# Altium schematic sheet User IO Buffers.SchDoc
size A1; SheetNumber: 13; SheetTotal: 13
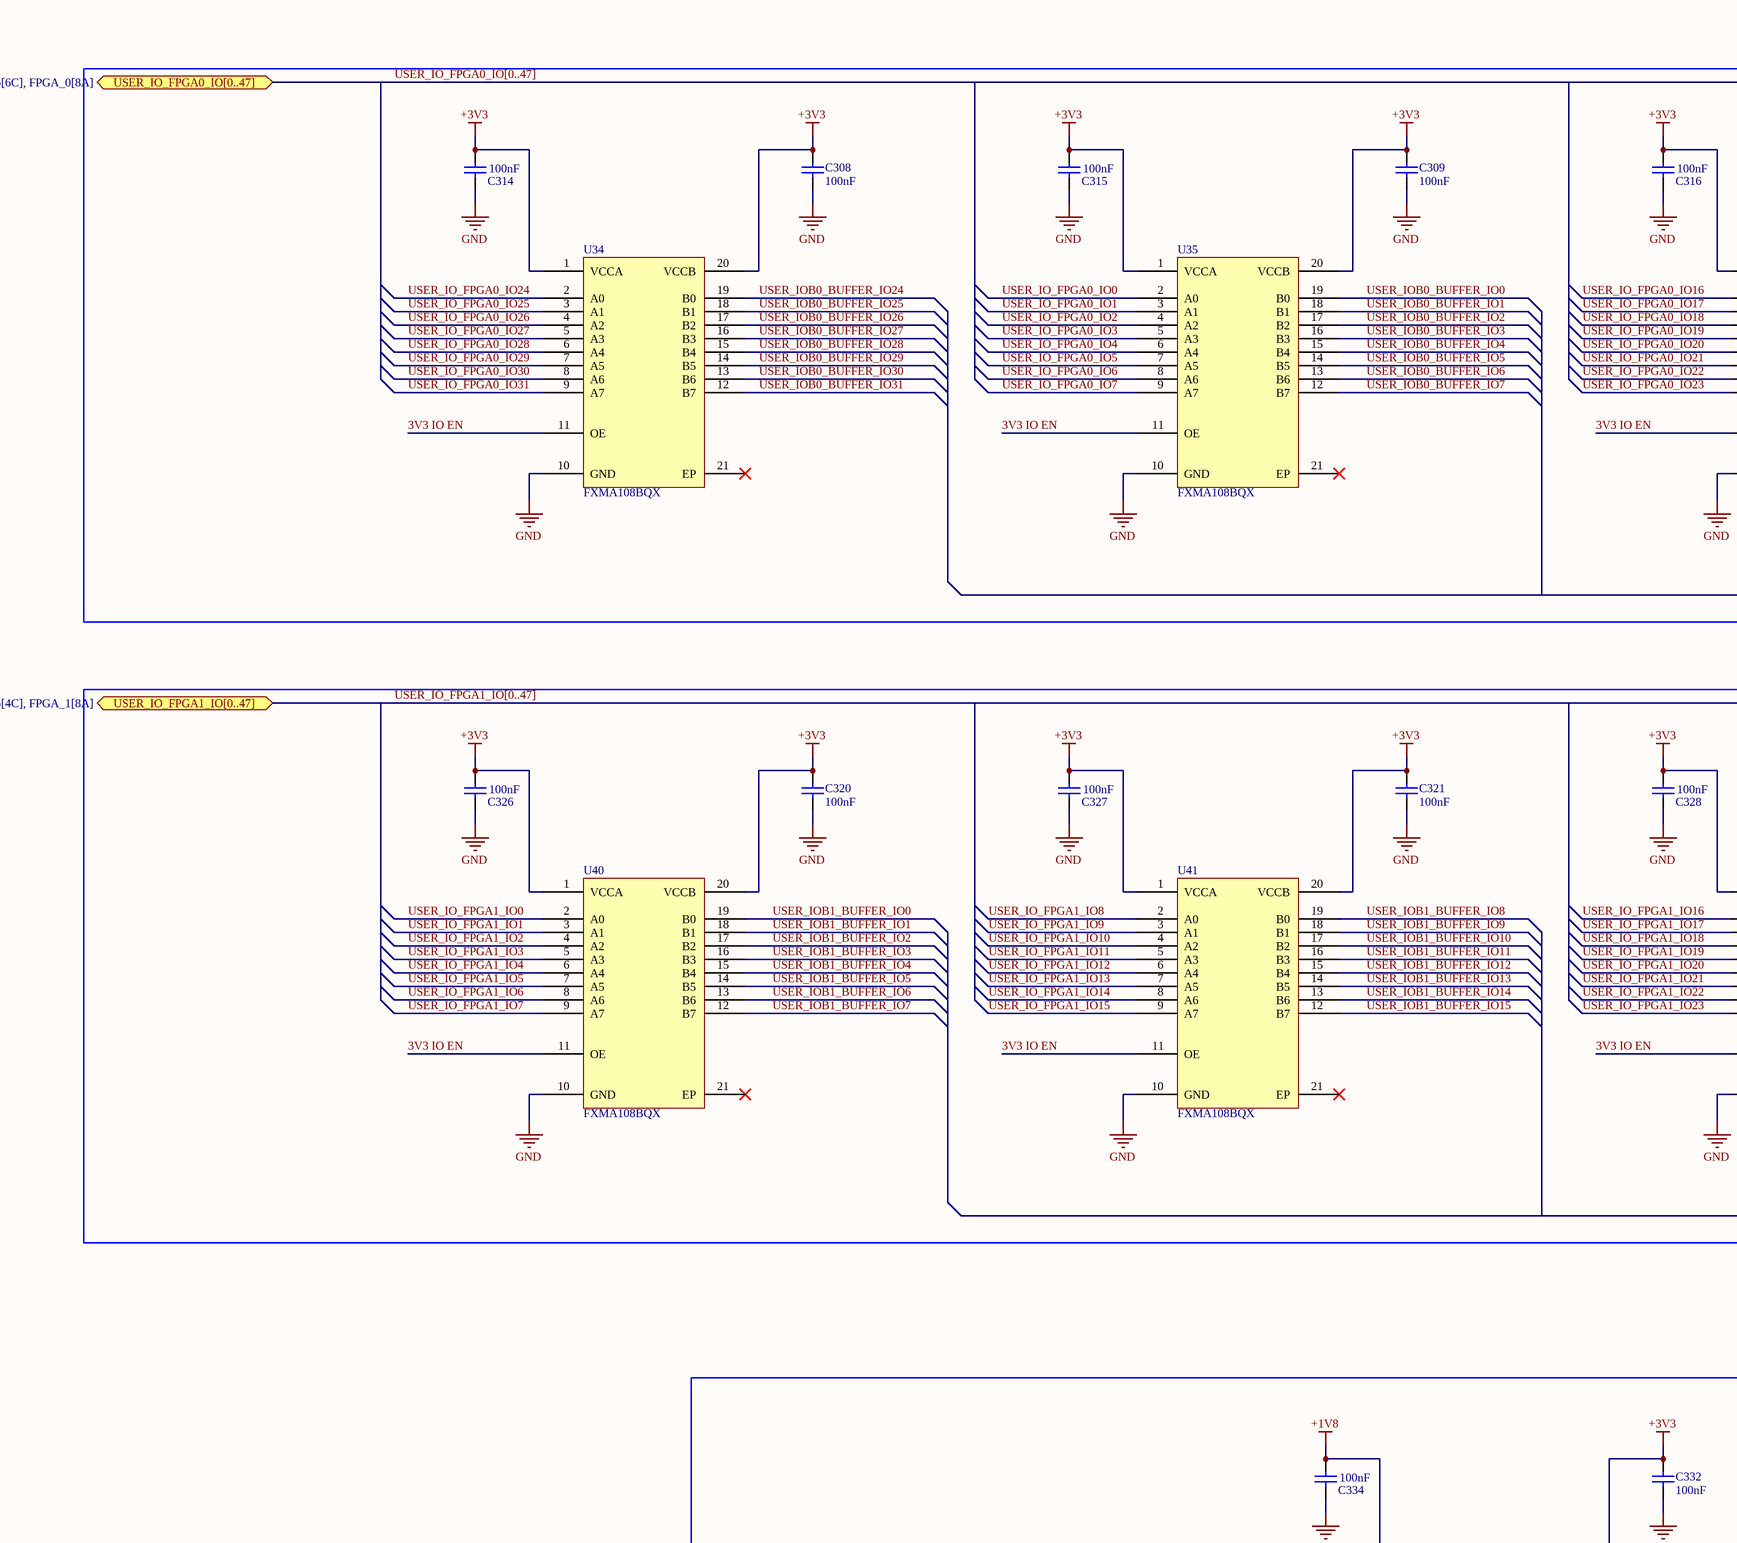
[diagram p0: User IO Buffers.SchDoc, top left]
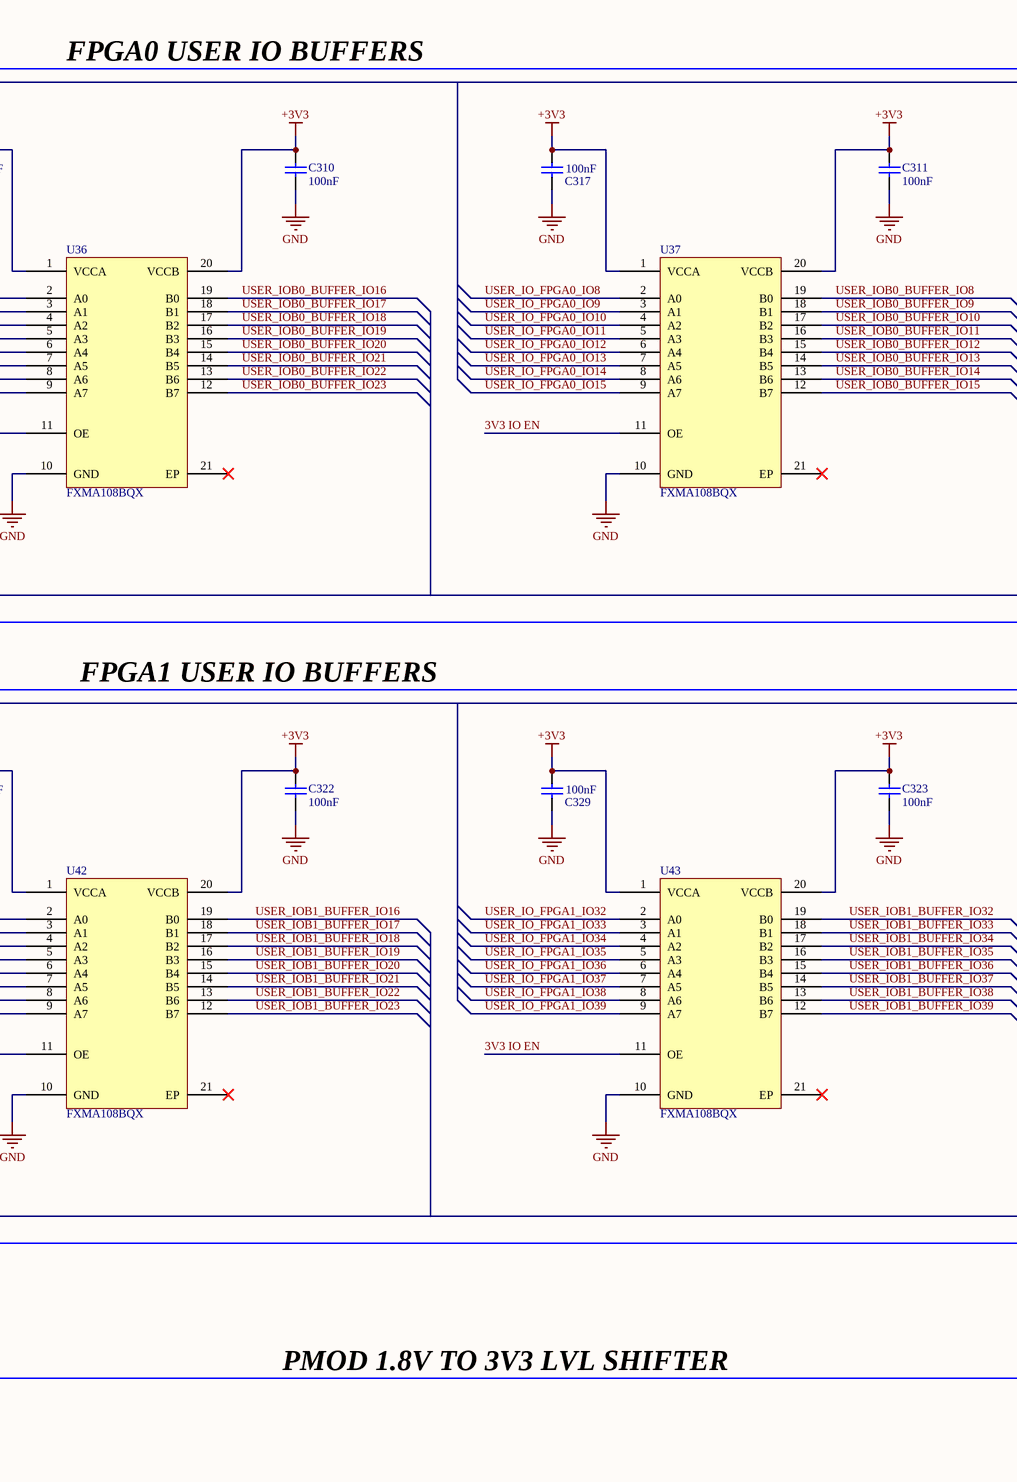
[diagram p1: User IO Buffers.SchDoc, top middle]
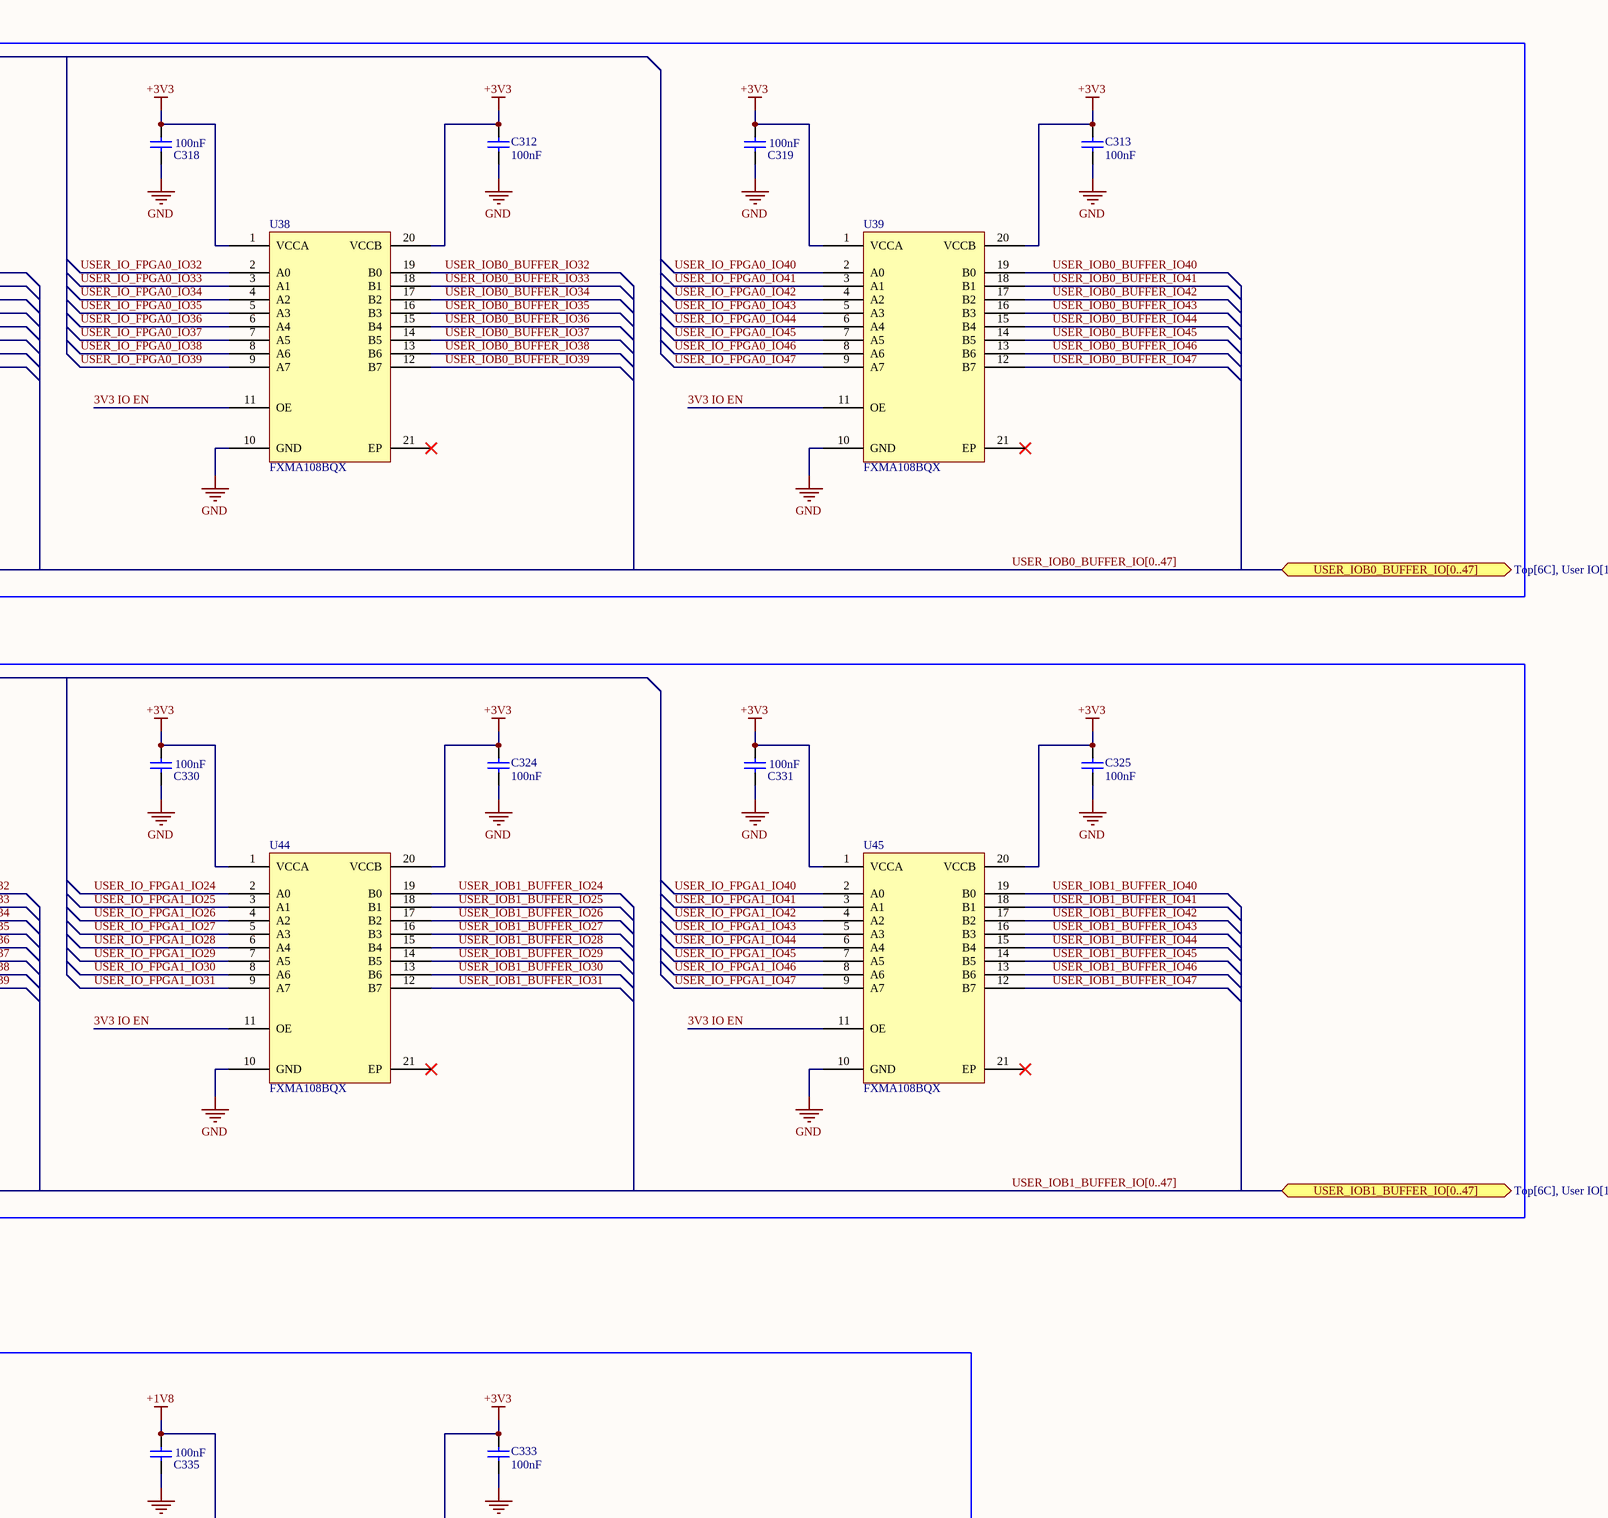
[diagram p2: User IO Buffers.SchDoc, top right]
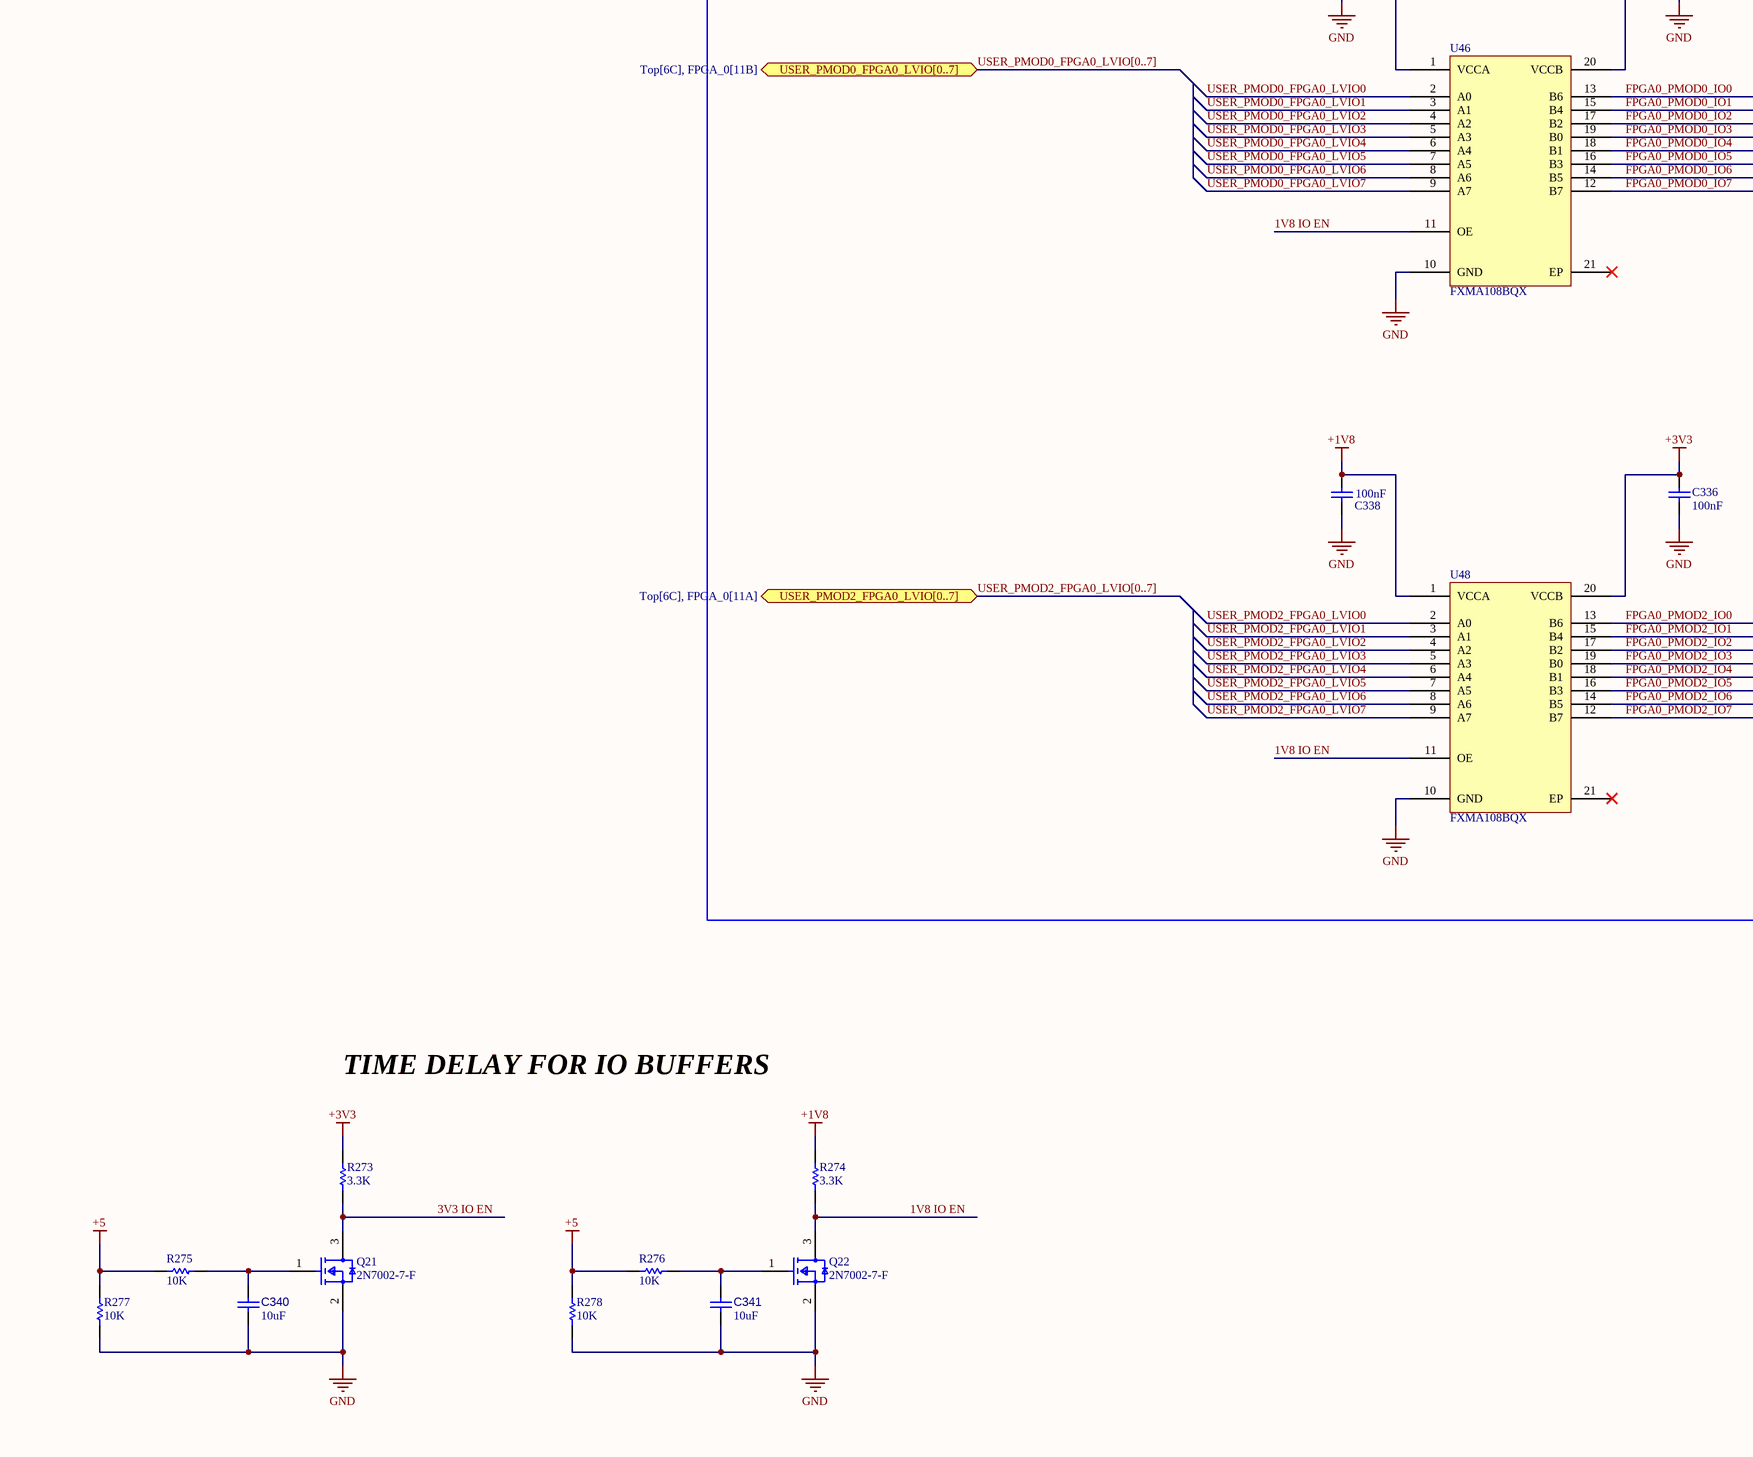
[diagram p3: User IO Buffers.SchDoc, bottom left]
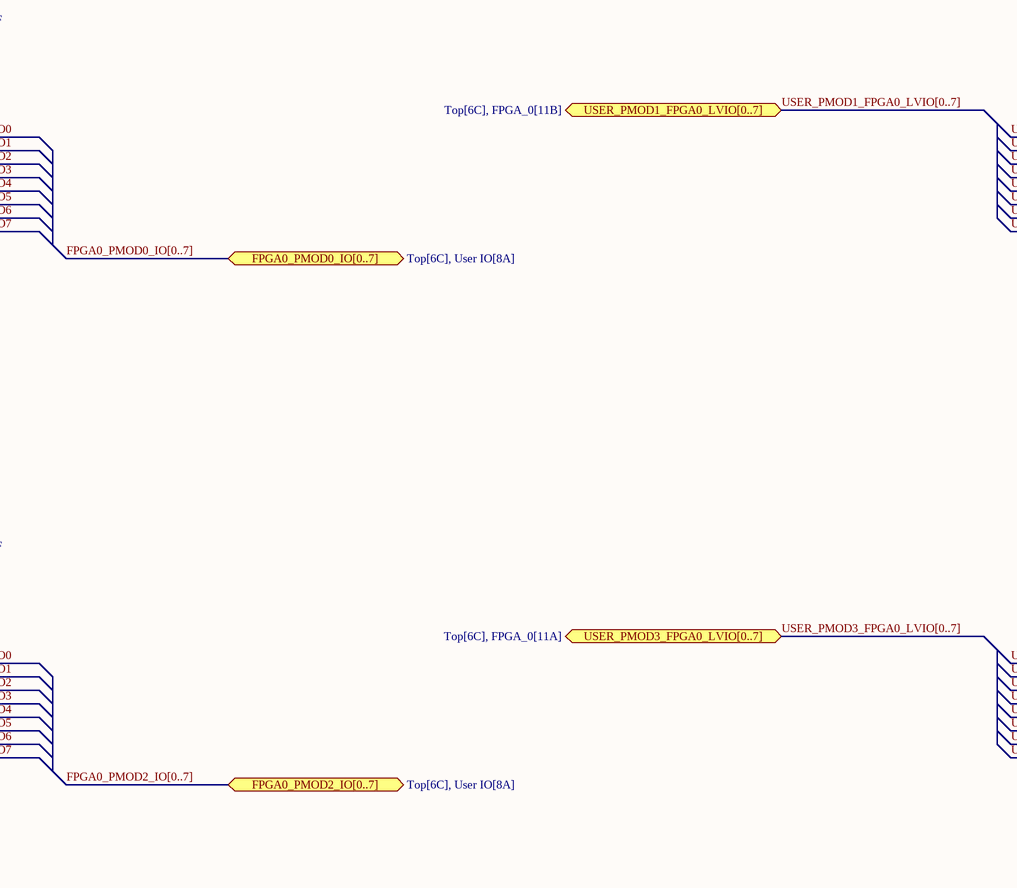
[diagram p4: User IO Buffers.SchDoc, bottom middle]
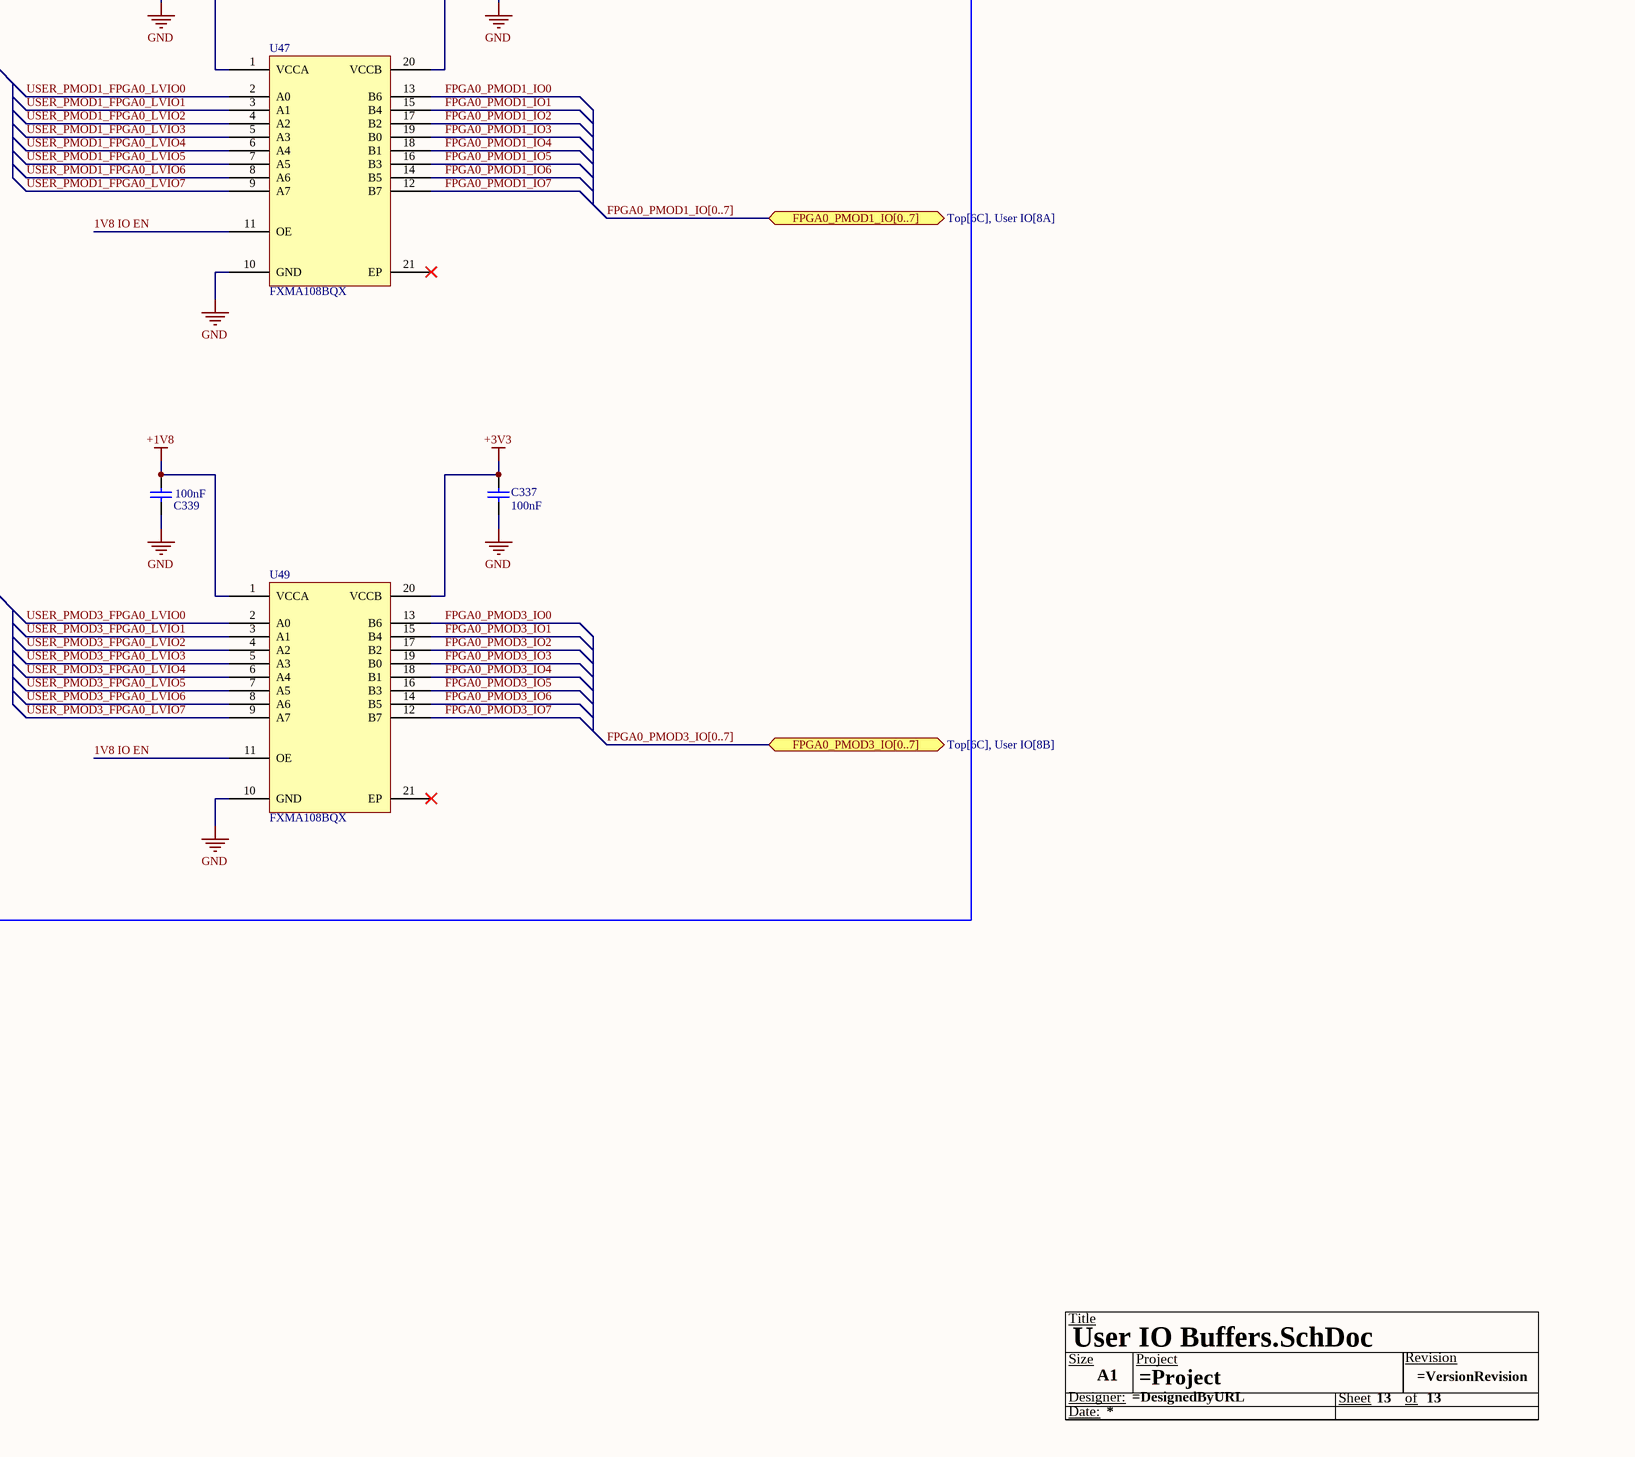
[diagram p5: User IO Buffers.SchDoc, bottom right]

## Parts
*  Size: A1  (hidden comment: Title Block)  (graphical)
C308  100nF  [CAPC1005X05N]
C309  100nF  [CAPC1005X05N]
C310  100nF  [CAPC1005X05N]
C311  100nF  [CAPC1005X05N]
C312  100nF  [CAPC1005X05N]
C313  100nF  [CAPC1005X05N]
C314  100nF  [CAPC1005X05N]
C315  100nF  [CAPC1005X05N]
C316  100nF  [CAPC1005X05N]
C317  100nF  [CAPC1005X05N]
C318  100nF  [CAPC1005X05N]
C319  100nF  [CAPC1005X05N]
C320  100nF  [CAPC1005X05N]
C321  100nF  [CAPC1005X05N]
C322  100nF  [CAPC1005X05N]
C323  100nF  [CAPC1005X05N]
C324  100nF  [CAPC1005X05N]
C325  100nF  [CAPC1005X05N]
C326  100nF  [CAPC1005X05N]
C327  100nF  [CAPC1005X05N]
C328  100nF  [CAPC1005X05N]
C329  100nF  [CAPC1005X05N]
C330  100nF  [CAPC1005X05N]
C331  100nF  [CAPC1005X05N]
C332  100nF  [CAPC1005X05N]
C333  100nF  [CAPC1005X05N]
C334  100nF  [CAPC1005X05N]
C335  100nF  [CAPC1005X05N]
C336  100nF  [CAPC1005X05N]
C337  100nF  [CAPC1005X05N]
C338  100nF  [CAPC1005X05N]
C339  100nF  [CAPC1005X05N]
C340  value 10uF  [CAPC1608X04N]  (hidden comment: GRM188R61E106MA73D)
C341  value 10uF  [CAPC1608X04N]  (hidden comment: GRM188R61E106MA73D)
Q21  2N7002-7-F  [FP-SOT23-MFG]
Q22  2N7002-7-F  [FP-SOT23-MFG]
R273  3.3K  [RESC1005X40X25NL05T10]
R274  3.3K  [RESC1005X40X25NL05T10]
R275  10K  [RESC1005X40X25NL05T10]
R276  10K  [RESC1005X40X25NL05T10]
R277  10K  [RESC1005X40X25NL05T10]
R278  10K  [RESC1005X40X25NL05T10]
U34  FXMA108BQX  [QFN50P450X250X80_HS-21N]
U35  FXMA108BQX  [QFN50P450X250X80_HS-21N]
U36  FXMA108BQX  [QFN50P450X250X80_HS-21N]
U37  FXMA108BQX  [QFN50P450X250X80_HS-21N]
U38  FXMA108BQX  [QFN50P450X250X80_HS-21N]
U39  FXMA108BQX  [QFN50P450X250X80_HS-21N]
U40  FXMA108BQX  [QFN50P450X250X80_HS-21N]
U41  FXMA108BQX  [QFN50P450X250X80_HS-21N]
U42  FXMA108BQX  [QFN50P450X250X80_HS-21N]
U43  FXMA108BQX  [QFN50P450X250X80_HS-21N]
U44  FXMA108BQX  [QFN50P450X250X80_HS-21N]
U45  FXMA108BQX  [QFN50P450X250X80_HS-21N]
U46  FXMA108BQX  [QFN50P450X250X80_HS-21N]
U47  FXMA108BQX  [QFN50P450X250X80_HS-21N]
U48  FXMA108BQX  [QFN50P450X250X80_HS-21N]
U49  FXMA108BQX  [QFN50P450X250X80_HS-21N]

## Blocks framed on the sheet
FPGA0 USER IO BUFFERS: C308-C319 U34-U39
FPGA1 USER IO BUFFERS: C320-C331 U40-U45
PMOD 1.8V TO 3V3 LVL SHIFTER: C332-C339 U46-U49

## Ports
FPGA0_PMOD0_IO[0..7] (bidir, see Top[6C], User IO[8A]), FPGA0_PMOD1_IO[0..7] (bidir, see Top[6C], User IO[8A]), FPGA0_PMOD2_IO[0..7] (bidir, see Top[6C], User IO[8A]), FPGA0_PMOD3_IO[0..7] (bidir, see Top[6C], User IO[8B]), USER_IO_FPGA0_IO[0..47] (bidir, see Top[6C], FPGA_0[8A]), USER_IO_FPGA1_IO[0..47] (bidir, see Top[4C], FPGA_1[8A]), USER_IOB0_BUFFER_IO[0..47] (bidir, see Top[6C], User IO[1A]), USER_IOB1_BUFFER_IO[0..47] (bidir, see Top[6C], User IO[1B]), USER_PMOD0_FPGA0_LVIO[0..7] (bidir, see Top[6C], FPGA_0[11B]), USER_PMOD1_FPGA0_LVIO[0..7] (bidir, see Top[6C], FPGA_0[11B]), USER_PMOD2_FPGA0_LVIO[0..7] (bidir, see Top[6C], FPGA_0[11A]), USER_PMOD3_FPGA0_LVIO[0..7] (bidir, see Top[6C], FPGA_0[11A])

## Nets
+1V8: C334.2 C335.2 C338.2 C339.2 R274.2 U46.1(VCCA) U47.1(VCCA) U48.1(VCCA) U49.1(VCCA)
+3V3: C308.2 C309.2 C310.2 C311.2 C312.2 C313.2 C314.2 C315.2 C316.2 C317.2 C318.2 C319.2 C320.2 C321.2 C322.2 C323.2 C324.2 C325.2 C326.2 C327.2 C328.2 C329.2 C330.2 C331.2 C332.2 C333.2 C336.2 C337.2 R273.2 U34.1(VCCA) U34.20(VCCB) U35.1(VCCA) U35.20(VCCB) U36.1(VCCA) U36.20(VCCB) U37.1(VCCA) U37.20(VCCB) U38.1(VCCA) U38.20(VCCB) U39.1(VCCA) U39.20(VCCB) U40.1(VCCA) U40.20(VCCB) U41.1(VCCA) U41.20(VCCB) U42.1(VCCA) U42.20(VCCB) U43.1(VCCA) U43.20(VCCB) U44.1(VCCA) U44.20(VCCB) U45.1(VCCA) U45.20(VCCB) U46.20(VCCB) U47.20(VCCB) U48.20(VCCB) U49.20(VCCB)
+5: R275.2 R276.2 R277.1 R278.1
GND: C308.1 C309.1 C310.1 C311.1 C312.1 C313.1 C314.1 C315.1 C316.1 C317.1 C318.1 C319.1 C320.1 C321.1 C322.1 C323.1 C324.1 C325.1 C326.1 C327.1 C328.1 C329.1 C330.1 C331.1 C332.1 C333.1 C334.1 C335.1 C336.1 C337.1 C338.1 C339.1 C340.1 C341.1 Q21.2(S) Q22.2(S) R277.2 R278.2 U34.10(GND) U35.10(GND) U36.10(GND) U37.10(GND) U38.10(GND) U39.10(GND) U40.10(GND) U41.10(GND) U42.10(GND) U43.10(GND) U44.10(GND) U45.10(GND) U46.10(GND) U47.10(GND) U48.10(GND) U49.10(GND)
1V8 IO EN: Q22.3(D) R274.1 U46.11(OE) U47.11(OE) U48.11(OE) U49.11(OE)
3V3 IO EN: Q21.3(D) R273.1 U34.11(OE) U35.11(OE) U36.11(OE) U37.11(OE) U38.11(OE) U39.11(OE) U40.11(OE) U41.11(OE) U42.11(OE) U43.11(OE) U44.11(OE) U45.11(OE)
FPGA0_PMOD0_IO0: U46.13(B6)
FPGA0_PMOD0_IO1: U46.15(B4)
FPGA0_PMOD0_IO2: U46.17(B2)
FPGA0_PMOD0_IO3: U46.19(B0)
FPGA0_PMOD0_IO4: U46.18(B1)
FPGA0_PMOD0_IO5: U46.16(B3)
FPGA0_PMOD0_IO6: U46.14(B5)
FPGA0_PMOD0_IO7: U46.12(B7)
FPGA0_PMOD1_IO0: U47.13(B6)
FPGA0_PMOD1_IO1: U47.15(B4)
FPGA0_PMOD1_IO2: U47.17(B2)
FPGA0_PMOD1_IO3: U47.19(B0)
FPGA0_PMOD1_IO4: U47.18(B1)
FPGA0_PMOD1_IO5: U47.16(B3)
FPGA0_PMOD1_IO6: U47.14(B5)
FPGA0_PMOD1_IO7: U47.12(B7)
FPGA0_PMOD2_IO0: U48.13(B6)
FPGA0_PMOD2_IO1: U48.15(B4)
FPGA0_PMOD2_IO2: U48.17(B2)
FPGA0_PMOD2_IO3: U48.19(B0)
FPGA0_PMOD2_IO4: U48.18(B1)
FPGA0_PMOD2_IO5: U48.16(B3)
FPGA0_PMOD2_IO6: U48.14(B5)
FPGA0_PMOD2_IO7: U48.12(B7)
FPGA0_PMOD3_IO0: U49.13(B6)
FPGA0_PMOD3_IO1: U49.15(B4)
FPGA0_PMOD3_IO2: U49.17(B2)
FPGA0_PMOD3_IO3: U49.19(B0)
FPGA0_PMOD3_IO4: U49.18(B1)
FPGA0_PMOD3_IO5: U49.16(B3)
FPGA0_PMOD3_IO6: U49.14(B5)
FPGA0_PMOD3_IO7: U49.12(B7)
USER_IO_FPGA0_IO0: U35.2(A0)
USER_IO_FPGA0_IO1: U35.3(A1)
USER_IO_FPGA0_IO2: U35.4(A2)
USER_IO_FPGA0_IO3: U35.5(A3)
USER_IO_FPGA0_IO4: U35.6(A4)
USER_IO_FPGA0_IO5: U35.7(A5)
USER_IO_FPGA0_IO6: U35.8(A6)
USER_IO_FPGA0_IO7: U35.9(A7)
USER_IO_FPGA0_IO8: U37.2(A0)
USER_IO_FPGA0_IO9: U37.3(A1)
USER_IO_FPGA0_IO10: U37.4(A2)
USER_IO_FPGA0_IO11: U37.5(A3)
USER_IO_FPGA0_IO12: U37.6(A4)
USER_IO_FPGA0_IO13: U37.7(A5)
USER_IO_FPGA0_IO14: U37.8(A6)
USER_IO_FPGA0_IO15: U37.9(A7)
USER_IO_FPGA0_IO16: U36.2(A0)
USER_IO_FPGA0_IO17: U36.3(A1)
USER_IO_FPGA0_IO18: U36.4(A2)
USER_IO_FPGA0_IO19: U36.5(A3)
USER_IO_FPGA0_IO20: U36.6(A4)
USER_IO_FPGA0_IO21: U36.7(A5)
USER_IO_FPGA0_IO22: U36.8(A6)
USER_IO_FPGA0_IO23: U36.9(A7)
USER_IO_FPGA0_IO24: U34.2(A0)
USER_IO_FPGA0_IO25: U34.3(A1)
USER_IO_FPGA0_IO26: U34.4(A2)
USER_IO_FPGA0_IO27: U34.5(A3)
USER_IO_FPGA0_IO28: U34.6(A4)
USER_IO_FPGA0_IO29: U34.7(A5)
USER_IO_FPGA0_IO30: U34.8(A6)
USER_IO_FPGA0_IO31: U34.9(A7)
USER_IO_FPGA0_IO32: U38.2(A0)
USER_IO_FPGA0_IO33: U38.3(A1)
USER_IO_FPGA0_IO34: U38.4(A2)
USER_IO_FPGA0_IO35: U38.5(A3)
USER_IO_FPGA0_IO36: U38.6(A4)
USER_IO_FPGA0_IO37: U38.7(A5)
USER_IO_FPGA0_IO38: U38.8(A6)
USER_IO_FPGA0_IO39: U38.9(A7)
USER_IO_FPGA0_IO40: U39.2(A0)
USER_IO_FPGA0_IO41: U39.3(A1)
USER_IO_FPGA0_IO42: U39.4(A2)
USER_IO_FPGA0_IO43: U39.5(A3)
USER_IO_FPGA0_IO44: U39.6(A4)
USER_IO_FPGA0_IO45: U39.7(A5)
USER_IO_FPGA0_IO46: U39.8(A6)
USER_IO_FPGA0_IO47: U39.9(A7)
USER_IO_FPGA1_IO0: U40.2(A0)
USER_IO_FPGA1_IO1: U40.3(A1)
USER_IO_FPGA1_IO2: U40.4(A2)
USER_IO_FPGA1_IO3: U40.5(A3)
USER_IO_FPGA1_IO4: U40.6(A4)
USER_IO_FPGA1_IO5: U40.7(A5)
USER_IO_FPGA1_IO6: U40.8(A6)
USER_IO_FPGA1_IO7: U40.9(A7)
USER_IO_FPGA1_IO8: U41.2(A0)
USER_IO_FPGA1_IO9: U41.3(A1)
USER_IO_FPGA1_IO10: U41.4(A2)
USER_IO_FPGA1_IO11: U41.5(A3)
USER_IO_FPGA1_IO12: U41.6(A4)
USER_IO_FPGA1_IO13: U41.7(A5)
USER_IO_FPGA1_IO14: U41.8(A6)
USER_IO_FPGA1_IO15: U41.9(A7)
USER_IO_FPGA1_IO16: U42.2(A0)
USER_IO_FPGA1_IO17: U42.3(A1)
USER_IO_FPGA1_IO18: U42.4(A2)
USER_IO_FPGA1_IO19: U42.5(A3)
USER_IO_FPGA1_IO20: U42.6(A4)
USER_IO_FPGA1_IO21: U42.7(A5)
USER_IO_FPGA1_IO22: U42.8(A6)
USER_IO_FPGA1_IO23: U42.9(A7)
USER_IO_FPGA1_IO24: U44.2(A0)
USER_IO_FPGA1_IO25: U44.3(A1)
USER_IO_FPGA1_IO26: U44.4(A2)
USER_IO_FPGA1_IO27: U44.5(A3)
USER_IO_FPGA1_IO28: U44.6(A4)
USER_IO_FPGA1_IO29: U44.7(A5)
USER_IO_FPGA1_IO30: U44.8(A6)
USER_IO_FPGA1_IO31: U44.9(A7)
USER_IO_FPGA1_IO32: U43.2(A0)
USER_IO_FPGA1_IO33: U43.3(A1)
USER_IO_FPGA1_IO34: U43.4(A2)
USER_IO_FPGA1_IO35: U43.5(A3)
USER_IO_FPGA1_IO36: U43.6(A4)
USER_IO_FPGA1_IO37: U43.7(A5)
USER_IO_FPGA1_IO38: U43.8(A6)
USER_IO_FPGA1_IO39: U43.9(A7)
USER_IO_FPGA1_IO40: U45.2(A0)
USER_IO_FPGA1_IO41: U45.3(A1)
USER_IO_FPGA1_IO42: U45.4(A2)
USER_IO_FPGA1_IO43: U45.5(A3)
USER_IO_FPGA1_IO44: U45.6(A4)
USER_IO_FPGA1_IO45: U45.7(A5)
USER_IO_FPGA1_IO46: U45.8(A6)
USER_IO_FPGA1_IO47: U45.9(A7)
USER_IOB0_BUFFER_IO0: U35.19(B0)
USER_IOB0_BUFFER_IO1: U35.18(B1)
USER_IOB0_BUFFER_IO2: U35.17(B2)
USER_IOB0_BUFFER_IO3: U35.16(B3)
USER_IOB0_BUFFER_IO4: U35.15(B4)
USER_IOB0_BUFFER_IO5: U35.14(B5)
USER_IOB0_BUFFER_IO6: U35.13(B6)
USER_IOB0_BUFFER_IO7: U35.12(B7)
USER_IOB0_BUFFER_IO8: U37.19(B0)
USER_IOB0_BUFFER_IO9: U37.18(B1)
USER_IOB0_BUFFER_IO10: U37.17(B2)
USER_IOB0_BUFFER_IO11: U37.16(B3)
USER_IOB0_BUFFER_IO12: U37.15(B4)
USER_IOB0_BUFFER_IO13: U37.14(B5)
USER_IOB0_BUFFER_IO14: U37.13(B6)
USER_IOB0_BUFFER_IO15: U37.12(B7)
USER_IOB0_BUFFER_IO16: U36.19(B0)
USER_IOB0_BUFFER_IO17: U36.18(B1)
USER_IOB0_BUFFER_IO18: U36.17(B2)
USER_IOB0_BUFFER_IO19: U36.16(B3)
USER_IOB0_BUFFER_IO20: U36.15(B4)
USER_IOB0_BUFFER_IO21: U36.14(B5)
USER_IOB0_BUFFER_IO22: U36.13(B6)
USER_IOB0_BUFFER_IO23: U36.12(B7)
USER_IOB0_BUFFER_IO24: U34.19(B0)
USER_IOB0_BUFFER_IO25: U34.18(B1)
USER_IOB0_BUFFER_IO26: U34.17(B2)
USER_IOB0_BUFFER_IO27: U34.16(B3)
USER_IOB0_BUFFER_IO28: U34.15(B4)
USER_IOB0_BUFFER_IO29: U34.14(B5)
USER_IOB0_BUFFER_IO30: U34.13(B6)
USER_IOB0_BUFFER_IO31: U34.12(B7)
USER_IOB0_BUFFER_IO32: U38.19(B0)
USER_IOB0_BUFFER_IO33: U38.18(B1)
USER_IOB0_BUFFER_IO34: U38.17(B2)
USER_IOB0_BUFFER_IO35: U38.16(B3)
USER_IOB0_BUFFER_IO36: U38.15(B4)
USER_IOB0_BUFFER_IO37: U38.14(B5)
USER_IOB0_BUFFER_IO38: U38.13(B6)
USER_IOB0_BUFFER_IO39: U38.12(B7)
USER_IOB0_BUFFER_IO40: U39.19(B0)
USER_IOB0_BUFFER_IO41: U39.18(B1)
USER_IOB0_BUFFER_IO42: U39.17(B2)
USER_IOB0_BUFFER_IO43: U39.16(B3)
USER_IOB0_BUFFER_IO44: U39.15(B4)
USER_IOB0_BUFFER_IO45: U39.14(B5)
USER_IOB0_BUFFER_IO46: U39.13(B6)
USER_IOB0_BUFFER_IO47: U39.12(B7)
USER_IOB1_BUFFER_IO0: U40.19(B0)
USER_IOB1_BUFFER_IO1: U40.18(B1)
USER_IOB1_BUFFER_IO2: U40.17(B2)
USER_IOB1_BUFFER_IO3: U40.16(B3)
USER_IOB1_BUFFER_IO4: U40.15(B4)
USER_IOB1_BUFFER_IO5: U40.14(B5)
USER_IOB1_BUFFER_IO6: U40.13(B6)
USER_IOB1_BUFFER_IO7: U40.12(B7)
USER_IOB1_BUFFER_IO8: U41.19(B0)
USER_IOB1_BUFFER_IO9: U41.18(B1)
USER_IOB1_BUFFER_IO10: U41.17(B2)
USER_IOB1_BUFFER_IO11: U41.16(B3)
USER_IOB1_BUFFER_IO12: U41.15(B4)
USER_IOB1_BUFFER_IO13: U41.14(B5)
USER_IOB1_BUFFER_IO14: U41.13(B6)
USER_IOB1_BUFFER_IO15: U41.12(B7)
USER_IOB1_BUFFER_IO16: U42.19(B0)
USER_IOB1_BUFFER_IO17: U42.18(B1)
USER_IOB1_BUFFER_IO18: U42.17(B2)
USER_IOB1_BUFFER_IO19: U42.16(B3)
USER_IOB1_BUFFER_IO20: U42.15(B4)
USER_IOB1_BUFFER_IO21: U42.14(B5)
USER_IOB1_BUFFER_IO22: U42.13(B6)
USER_IOB1_BUFFER_IO23: U42.12(B7)
USER_IOB1_BUFFER_IO24: U44.19(B0)
USER_IOB1_BUFFER_IO25: U44.18(B1)
USER_IOB1_BUFFER_IO26: U44.17(B2)
USER_IOB1_BUFFER_IO27: U44.16(B3)
USER_IOB1_BUFFER_IO28: U44.15(B4)
USER_IOB1_BUFFER_IO29: U44.14(B5)
USER_IOB1_BUFFER_IO30: U44.13(B6)
USER_IOB1_BUFFER_IO31: U44.12(B7)
USER_IOB1_BUFFER_IO32: U43.19(B0)
USER_IOB1_BUFFER_IO33: U43.18(B1)
USER_IOB1_BUFFER_IO34: U43.17(B2)
USER_IOB1_BUFFER_IO35: U43.16(B3)
USER_IOB1_BUFFER_IO36: U43.15(B4)
USER_IOB1_BUFFER_IO37: U43.14(B5)
USER_IOB1_BUFFER_IO38: U43.13(B6)
USER_IOB1_BUFFER_IO39: U43.12(B7)
USER_IOB1_BUFFER_IO40: U45.19(B0)
USER_IOB1_BUFFER_IO41: U45.18(B1)
USER_IOB1_BUFFER_IO42: U45.17(B2)
USER_IOB1_BUFFER_IO43: U45.16(B3)
USER_IOB1_BUFFER_IO44: U45.15(B4)
USER_IOB1_BUFFER_IO45: U45.14(B5)
USER_IOB1_BUFFER_IO46: U45.13(B6)
USER_IOB1_BUFFER_IO47: U45.12(B7)
USER_PMOD0_FPGA0_LVIO0: U46.2(A0)
USER_PMOD0_FPGA0_LVIO1: U46.3(A1)
USER_PMOD0_FPGA0_LVIO2: U46.4(A2)
USER_PMOD0_FPGA0_LVIO3: U46.5(A3)
USER_PMOD0_FPGA0_LVIO4: U46.6(A4)
USER_PMOD0_FPGA0_LVIO5: U46.7(A5)
USER_PMOD0_FPGA0_LVIO6: U46.8(A6)
USER_PMOD0_FPGA0_LVIO7: U46.9(A7)
USER_PMOD1_FPGA0_LVIO0: U47.2(A0)
USER_PMOD1_FPGA0_LVIO1: U47.3(A1)
USER_PMOD1_FPGA0_LVIO2: U47.4(A2)
USER_PMOD1_FPGA0_LVIO3: U47.5(A3)
USER_PMOD1_FPGA0_LVIO4: U47.6(A4)
USER_PMOD1_FPGA0_LVIO5: U47.7(A5)
USER_PMOD1_FPGA0_LVIO6: U47.8(A6)
USER_PMOD1_FPGA0_LVIO7: U47.9(A7)
USER_PMOD2_FPGA0_LVIO0: U48.2(A0)
USER_PMOD2_FPGA0_LVIO1: U48.3(A1)
USER_PMOD2_FPGA0_LVIO2: U48.4(A2)
USER_PMOD2_FPGA0_LVIO3: U48.5(A3)
USER_PMOD2_FPGA0_LVIO4: U48.6(A4)
USER_PMOD2_FPGA0_LVIO5: U48.7(A5)
USER_PMOD2_FPGA0_LVIO6: U48.8(A6)
USER_PMOD2_FPGA0_LVIO7: U48.9(A7)
USER_PMOD3_FPGA0_LVIO0: U49.2(A0)
USER_PMOD3_FPGA0_LVIO1: U49.3(A1)
USER_PMOD3_FPGA0_LVIO2: U49.4(A2)
USER_PMOD3_FPGA0_LVIO3: U49.5(A3)
USER_PMOD3_FPGA0_LVIO4: U49.6(A4)
USER_PMOD3_FPGA0_LVIO5: U49.7(A5)
USER_PMOD3_FPGA0_LVIO6: U49.8(A6)
USER_PMOD3_FPGA0_LVIO7: U49.9(A7)
NetC340_2: C340.2 Q21.1(G) R275.1
NetC341_2: C341.2 Q22.1(G) R276.1

Not connected (* = marked no-connect by the designer): U34 21(EP)*; U35 21(EP)*; U36 21(EP)*; U37 21(EP)*; U38 21(EP)*; U39 21(EP)*; U40 21(EP)*; U41 21(EP)*; U42 21(EP)*; U43 21(EP)*; U44 21(EP)*; U45 21(EP)*; U46 21(EP)*; U47 21(EP)*; U48 21(EP)*; U49 21(EP)*

## Buses and harness runs
bus FPGA0_PMOD0_IO[0..7] = port FPGA0_PMOD0_IO[0..7]
bus FPGA0_PMOD1_IO[0..7] = port FPGA0_PMOD1_IO[0..7]
bus FPGA0_PMOD2_IO[0..7] = port FPGA0_PMOD2_IO[0..7]
bus FPGA0_PMOD3_IO[0..7] = port FPGA0_PMOD3_IO[0..7]
bus USER_IO_FPGA0_IO[0..47] = port USER_IO_FPGA0_IO[0..47]
bus USER_IO_FPGA1_IO[0..47] = port USER_IO_FPGA1_IO[0..47]
bus USER_IOB0_BUFFER_IO[0..47] = port USER_IOB0_BUFFER_IO[0..47]
bus USER_IOB1_BUFFER_IO[0..47] = port USER_IOB1_BUFFER_IO[0..47]
bus USER_PMOD0_FPGA0_LVIO[0..7] = port USER_PMOD0_FPGA0_LVIO[0..7]
bus USER_PMOD1_FPGA0_LVIO[0..7] = port USER_PMOD1_FPGA0_LVIO[0..7]
bus USER_PMOD2_FPGA0_LVIO[0..7] = port USER_PMOD2_FPGA0_LVIO[0..7]
bus USER_PMOD3_FPGA0_LVIO[0..7] = port USER_PMOD3_FPGA0_LVIO[0..7]

## Notes on the sheet
- TIME DELAY FOR IO BUFFERS
- (in symbol CMP-007-000006-8) Title; Size; Project; Revision; Designer:; Sheet; of; Date:

## Library data of the parts
* = CMP-007-000006-8: Generic Title Block
C308-C339 = CMP-001-00095-1: Cap Ceramic 0.1uF 50V X7R 20% SMD 0402 125°C Paper T/R GRM155R71H104ME14J; Voltage: 50V; Capacitance: 100nF; Case: 0402
C340 C341 = CMP-001-00096-1: CAP CER 10UF 25V X5R 0603; Tolerance: 20%; Dielectric: X5R; Case/Package: 0603; Voltage: 25V
Q21 Q22 = CMP-2000-04929-2: MOSFET N-CH 60V 115MA SOT23-3; Turn-On Delay Time: 7ns; Turn-Off Delay Time: 11ns; Drain to Source Resistance: 7.5R; Rise Time: 3ns; Drain to Source Breakdown Voltage: 70V; Input Capacitance: 50pF; Number of Elements: 1; Power Dissipation: 540mW; Max Power Dissipation: 300mW; Fall Time: 5.6ns; Gate to Source Voltage (Vgs): 20V; Threshold Voltage: 2.5V; Element Configuration: Single; Termination: SMD/SMT; Weight: 0.000282oz; Radiation Hardening: No; Max Operating Temperature: 150°C; On-State Resistance: 7.5R; Mount: Surface Mount; Current Rating: 115mA; Contact Plating: Tin; Lead Free: Lead Free; Min Operating Temperature: -55°C; Number of Pins: 3; REACH SVHC: No SVHC; Drain to Source Voltage (Vdss): 60V; Width: 1.3mm; Package Quantity: 3000; Length: 2.9mm; Case/Package: SOT-23; Number of Channels: 1; Dual Supply Voltage: 60V; Packaging: Tape and Reel; Height: 1mm; Voltage Rating (DC): 60V; Nominal Vgs: 2.5V; Continuous Drain Current (ID): 115mA; Voltage: 60V; Rds On Max: 7.5R
R273 R274 = CMP-2002-03055-1: CRCW04023K30FKEDHP; Manufacturer: Vishay Dale; Part Number: CRCW04023K30FKEDHP
R275-R278 = CMP-2002-07353-1: RC0402FR-0710KL; Manufacturer: Yageo / Phycomp; Part Number: RC0402FR-0710KL
U34-U49 = CMP-015-00018-1: FXMA108 Series 3.6 V Surface Mount Dual Supply 8-Bit Voltage Translator -DQFN-20; Min Supply Voltage: 1.65V; Propagation Delay: 1700ns; Number of Circuits: 1; Number of Channels: 8; Max Supply Voltage: 5.5V; Data Rate: 100Mbps; Logic Function: Translator; Case/Package: QFN